# EAGLE design BatMeas5.2 JST (EAGLE 9.4.2)
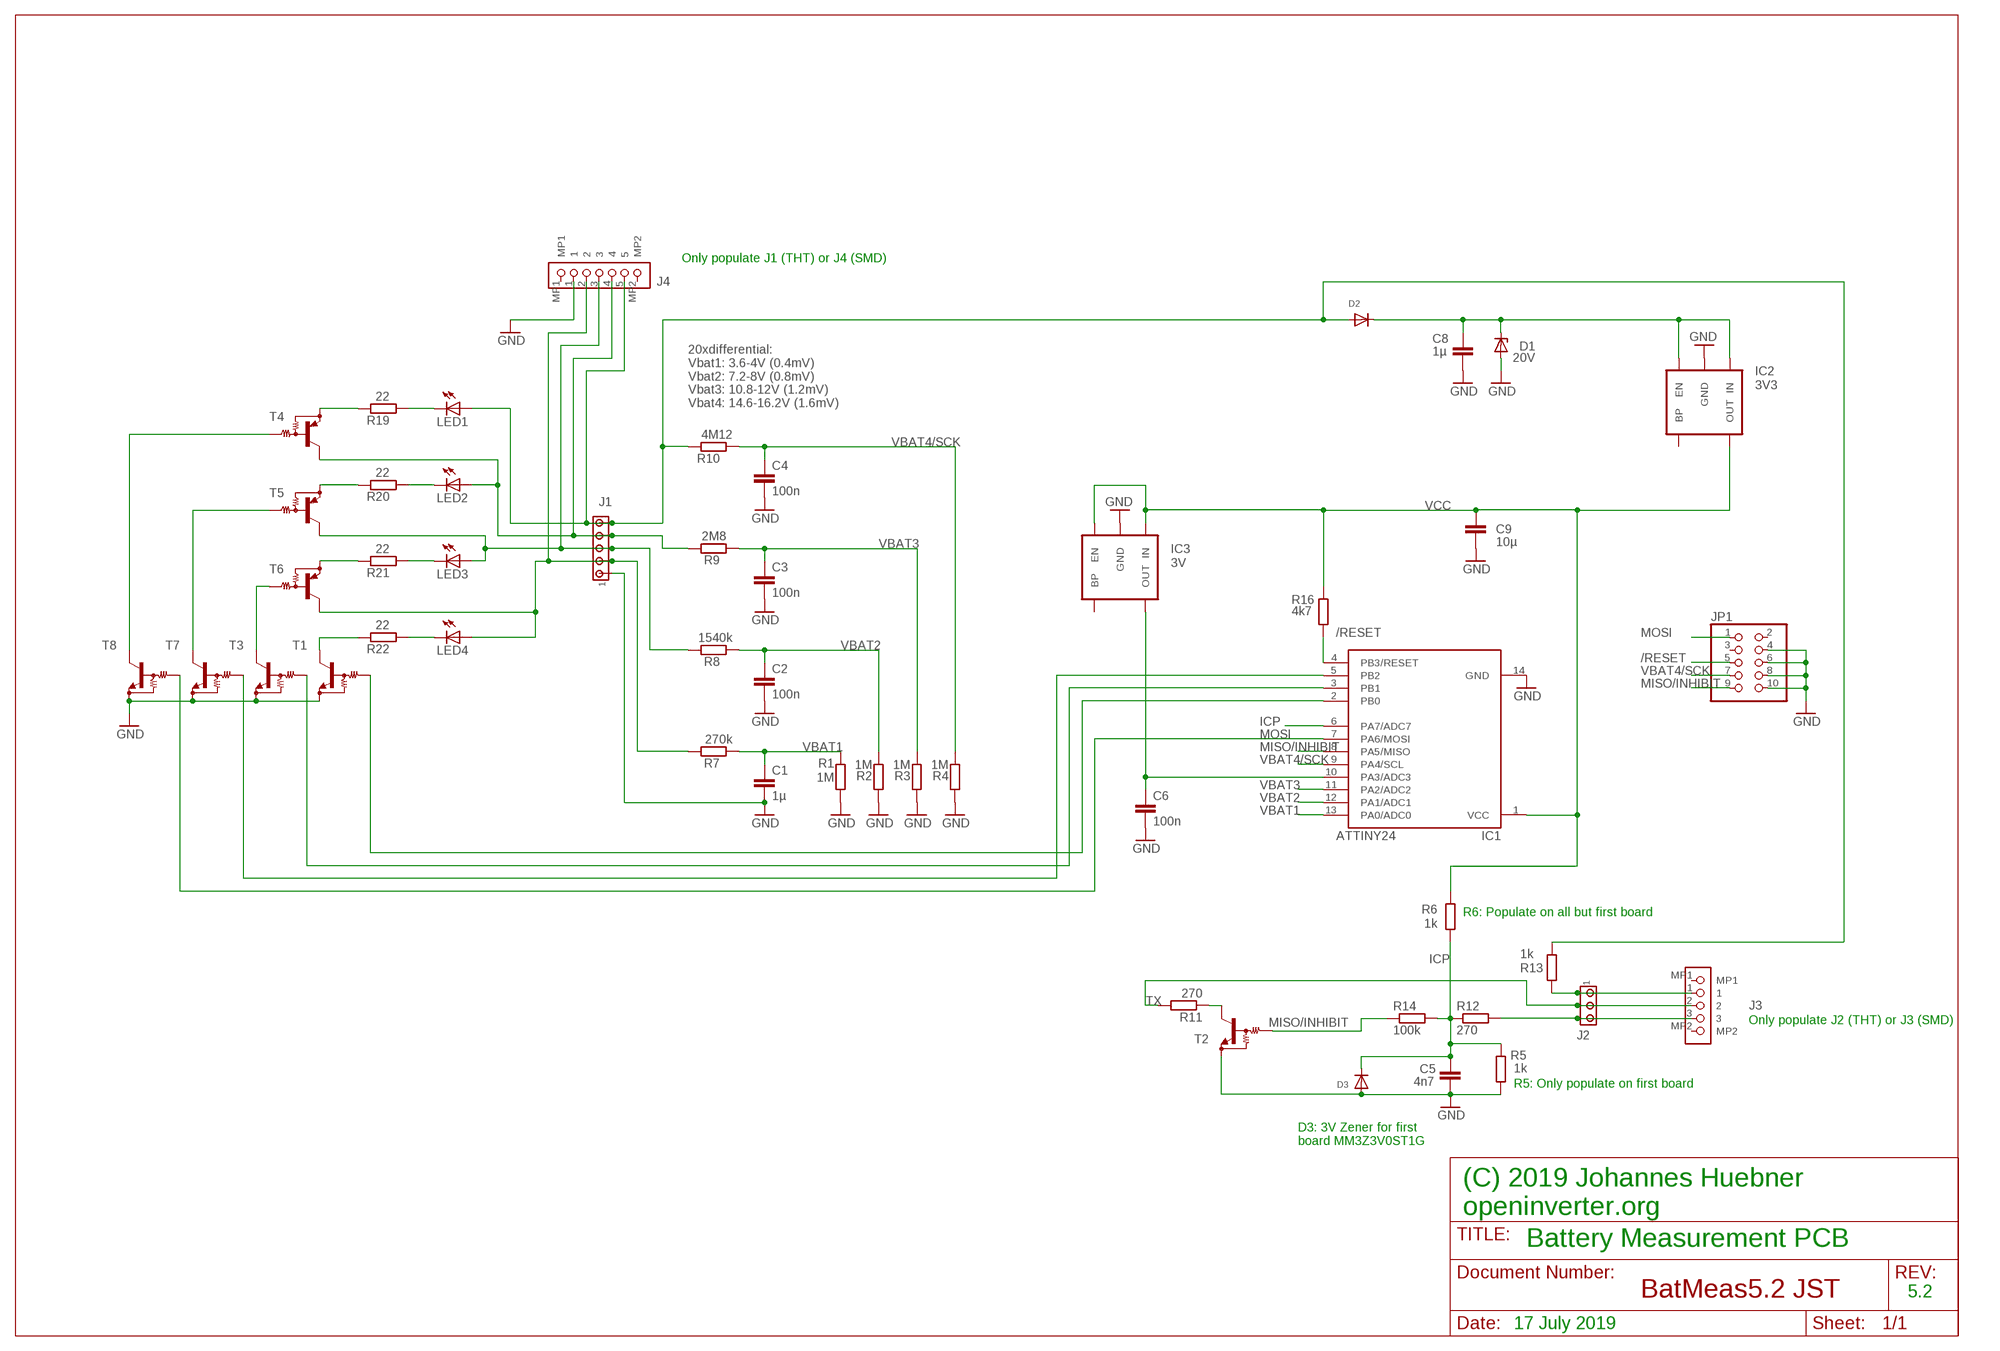
[diagram p0: schematic, sheet 1]

## Parts
C1  1µ  C-EUC0603  [C0603]
C2  100n  C-EUC0603  [C0603]
C3  100n  C-EUC0603  [C0603]
C4  100n  C-EUC0603  [C0603]
C5  4n7  C-EUC0603  [C0603]
C6  100n  C-EUC0603  [C0603]
C8  1µ  C-EUC0805  [C0805]
C9  10µ  C-EUC0805  [C0805]
D1  20V  ZENER-DIODESMB  [SMB]
D2  DIODESOD-323F  [SOD-323F]
D3  DIODESOD-323F  [SOD-323F]
IC1  ATTINY24  [SO014]
IC2  3V3  V_REG_LDOSMD  [SOT23-5]
IC3  3V  V_REG_LDOSMD  [SOT23-5]
J1  MTA05-100  [10X05MTA]
J2  MTA03-100  [10X03MTA]
J3  BM03B-PASS-1-TFT_(LF)(SN)  [BM03BPASS1TFTLFSN]
J4  BM05B-PASS-1-TFT_(LF)(SN)SMD  [BM05BPASS1TFTLFSN]
JP1  PINHD-2X5  [2X05]
LED1  150060GS75000  LEDCHIPLED_0805  [CHIPLED_0805]
LED2  150060GS75000  LEDCHIPLED_0805  [CHIPLED_0805]
LED3  150060GS75000  LEDCHIPLED_0805  [CHIPLED_0805]
LED4  150060GS75000  LEDCHIPLED_0805  [CHIPLED_0805]
R1  1M  R-EU_R0603  [R0603]
R2  1M  R-EU_R0603  [R0603]
R3  1M  R-EU_R0603  [R0603]
R4  1M  R-EU_R0603  [R0603]
R5  1k  R-EU_R0603  [R0603]
R6  1k  R-EU_R0603  [R0603]
R7  270k  R-EU_R0603  [R0603]
R8  1540k  R-EU_R0603  [R0603]
R9  2M8  R-EU_R0603  [R0603]
R10  4M12  R-EU_R0603  [R0603]
R11  270  R-EU_R0603  [R0603]
R12  270  R-EU_R0603  [R0603]
R13  1k  R-EU_R0603  [R0603]
R14  100k  R-EU_R0603  [R0603]
R16  4k7  R-EU_R0603  [R0603]
R19  22  R-EU_R0805  [R0805]
R20  22  R-EU_R0805  [R0805]
R21  22  R-EU_R0805  [R0805]
R22  22  R-EU_R0805  [R0805]
T1  MMUN2233  MUN2211T1-NPN_DRIVER-SC59-BEC  [SC59-BEC]
T2  MMUN2233  MUN2211T1-NPN_DRIVER-SC59-BEC  [SC59-BEC]
T3  MMUN2233  MUN2211T1-NPN_DRIVER-SC59-BEC  [SC59-BEC]
T4  MMUN2111LT1G  MUN2111T1-PNP_DRIVER-SC59-BEC  [SC59-BEC]
T5  MMUN2111LT1G  MUN2111T1-PNP_DRIVER-SC59-BEC  [SC59-BEC]
T6  MMUN2111LT1G  MUN2111T1-PNP_DRIVER-SC59-BEC  [SC59-BEC]
T7  MMUN2233  MUN2211T1-NPN_DRIVER-SC59-BEC  [SC59-BEC]
T8  MMUN2233  MUN2211T1-NPN_DRIVER-SC59-BEC  [SC59-BEC]

## Nets
/RESET: IC1.4(PB3/RESET) JP1.5 R16.2
GND: C1.2 C2.2 C3.2 C4.2 C5.2 C6.2 C8.2 C9.2 D1.A D3.A IC1.14(GND) IC2.2(GND) IC3.2(GND) J1.1 J4.1 JP1.4 JP1.6 JP1.8 JP1.10 R1.2 R2.2 R3.2 R4.2 R5.1 T1.E T2.E T3.E T7.E T8.E
ICP: C5.1 D3.C IC1.6(PA7/ADC7) R5.2 R6.1 R12.1 R14.2
MISO/INHIBIT: IC1.8(PA5/MISO) JP1.9 R14.1 T2.B
MOSI: IC1.7(PA6/MOSI) JP1.1 T8.B
N$1: T3.C T6.B
N$2: C6.1 IC1.10(PA3/ADC3) IC3.5(OUT)
N$3: IC1.2(PB0) T1.B
N$4: IC1.3(PB1) T3.B
N$5: R19.2 T4.E
N$6: LED1.C R19.1
N$10: IC1.5(PB2) T7.B
N$11: R20.2 T5.E
N$12: J2.1 J3.1 R13.2
N$13: LED2.C R20.1
N$14: R11.1 T2.C
N$17: D2.A J1.5 J4.5 LED1.A R10.2 R13.1
N$18: LED3.C R21.1
N$19: LED4.C R22.1
N$20: R21.2 T6.E
N$21: R22.2 T1.C
N$22: J2.3 J3.3 R12.2
N$23: J1.4 J4.4 LED2.A R9.2 T4.C
N$24: J1.3 J4.3 LED3.A R8.2 T5.C
N$25: J1.2 J4.2 LED4.A R7.2 T6.C
N$30: T5.B T7.C
N$31: T4.B T8.C
TX: J2.2 J3.2 R11.2
VBAT: C8.1 D1.C D2.C IC2.1(IN) IC2.3(EN)
VBAT1: C1.1 IC1.13(PA0/ADC0) R1.1 R7.1
VBAT2: C2.1 IC1.12(PA1/ADC1) R2.1 R8.1
VBAT3: C3.1 IC1.11(PA2/ADC2) R3.1 R9.1
VBAT4/SCK: C4.1 IC1.9(PA4/SCL) JP1.7 R4.1 R10.1
VCC: C9.1 IC1.1(VCC) IC2.5(OUT) IC3.1(IN) IC3.3(EN) R6.2 R16.1
Unconnected: IC2.4(BP) IC3.4(BP) J3.MP1 J3.MP2 J4.MP1 J4.MP2 JP1.2 JP1.3

## Notes on the sheet
- Only populate J1 (THT) or J4 (SMD)
- 20xdifferential:
  Vbat1: 3.6-4V (0.4mV)
  Vbat2: 7.2-8V (0.8mV)
  Vbat3: 10.8-12V (1.2mV)
  Vbat4: 14.6-16.2V (1.6mV)
- R6: Populate on all but first board
- Only populate J2 (THT) or J3 (SMD)
- R5: Only populate on first board
- D3: 3V Zener for first
  board MM3Z3V0ST1G
- (C) 2019 Johannes Huebner
  openinverter.org
- Battery Measurement PCB
- 5.2
- 17 July 2019

## Library data of the parts
C1-C6 C8 C9 = rcl:C-EU: CAPACITOR, European symbol
D1 = diode:ZENER-DIODE: Z-Diode
D2 D3 = adafruit:DIODE: Diode SMADIODE - SMA Surface Mount Package 20V 1A Schottky Diode Digikey: 641-1014-6-ND DO-1N4148 - Through Hole Small Current Diode SOD-123 20V 1 A (.5mV Vf) Schottky Diode - Digikey: MBRX120TPMSCT-ND SOD-323 10V 570mA (.38mV Vf, 3ns) Schottky Diode - Digikey: ZLLS410CT-ND SOD-523 30V 30mA Schottky Diode (RB751S-40TE61) - Digikey: RB751S-40TE61CT-ND SOT23-R/W - SOT23 Package (R = Solder Paste/Reflow Ovens, W = Hand-Soldering) BAT54Film 40V 300mA - Digikey: 497-7162-1-ND
IC1 = sparkfun:ATTINY24
IC2 IC3 = SparkFun-PowerIC:V_REG_LDO: Voltage Regulator LDO Standard 150mA LDO voltage regulator in SOT-23 layout. Micrel part MIC5205. BP (by-pass) pin is used to lower output noise with 470pF cap.
J1 = con-amp:MTA05-100: AMP connector
J2 = con-amp:MTA03-100: AMP connector
J3 = BM03B-PASS-1-TFT_(LF)(SN):BM03B-PASS-1-TFT_(LF)(SN): Conn Shrouded Header HDR 3 POS 2mm Solder ST SMD T/R Source: Datasheet <http://www.jst-mfg.com/product/pdf/eng/ePA-F.pdf>; DESCRIPTION: Conn Shrouded Header HDR 3 POS 2mm Solder ST SMD T/R; HEIGHT: 8.8mm; MANUFACTURER_NAME: JST (JAPAN SOLDERLESS TERMINALS); MANUFACTURER_PART_NUMBER: BM03B-PASS-1-TFT (LF)(SN)
J4 = BM03B-PASS-1-TFT_(LF)(SN):BM05B-PASS-1-TFT_(LF)(SN): Conn Shrouded Header HDR 5 POS 2mm Solder ST SMD T/R Source: Datasheet <http://www.jst-mfg.com/product/pdf/eng/ePA-F.pdf>
JP1 = pinhead:PINHD-2X5: PIN HEADER
LED1-LED4 = led:LED: LED OSRAM: - CHIPLED LG R971, LG N971, LY N971, LG Q971, LY Q971, LO R971, LY R971 LH N974, LH R974 LS Q976, LO Q976, LY Q976 LO Q996 - Hyper CHIPLED LW Q18S LB Q993, LB Q99A, LB R99A - SideLED LS A670, LO A670, LY A670, LG A670, LP A670 LB A673, LV A673, LT A673, LW A673 LH A674 LY A675 LS A676, LA A676, LO A676, LY A676, LW A676 LS A679, LY A679, LG A679 - Hyper Micro SIDELED® LS Y876, LA Y876, LO Y876, LY Y876 LT Y87S - SmartLED LW L88C, LW L88S LB L89C, LB L89S, LG L890 LS L89K, LO L89K, LY L89K LS L896, LA L896, LO L896, LY L896 - TOPLED LS T670, LO T670, LY T670, LG T670, LP T670 LSG T670, LSP T670, LSY T670, LOP T670, LYG T670 LG T671, LOG T671, LSG T671 LB T673, LV T673, LT T673, LW T673 LH T674 LS T676, LA T676, LO T676, LY T676, LB T676, LH T676, LSB T676, LW T676 LB T67C, LV T67C, LT T67C, LS T67K, LO T67K, LY T67K, LW E67C LS E67B, LA E67B, LO E67B, LY E67B, LB E67C, LV E67C, LT E67C LW T67C LS T679, LY T679, LG T679 LS T770, LO T770, LY T770, LG T770, LP T770 LB T773, LV T773, LT T773, LW T773 LH T774 LS E675, LA E675, LY E675, LS T675 LS T776, LA T776, LO T776, LY T776, LB T776 LHGB T686 LT T68C, LB T68C - Hyper Mini TOPLED® LB M676 - Mini TOPLED Santana® LG M470 LS M47K, LO M47K, LY M47K Source: http://www.osram.convergy.de LUXEON: - LUMILED® LXK2-PW12-R00, LXK2-PW12-S00, LXK2-PW14-U00, LXK2-PW14-V00 LXK2-PM12-R00, LXK2-PM12-S00, LXK2-PM14-U00 LXK2-PE12-Q00, LXK2-PE12-R00, LXK2-PE12-S00, LXK2-PE14-T00, LXK2-PE14-U00 LXK2-PB12-K00, LXK2-PB12-L00, LXK2-PB12-M00, LXK2-PB14-N00, LXK2-PB14-P00, LXK2-PB14-Q00 LXK2-PR12-L00, LXK2-PR12-M00, LXK2-PR14-Q00, LXK2-PR14-R00 LXK2-PD12-Q00, LXK2-PD12-R00, LXK2-PD12-S00 LXK2-PH12-R00, LXK2-PH12-S00 LXK2-PL12-P00, LXK2-PL12-Q00, LXK2-PL12-R00 Source: www.luxeon.com KINGBRIGHT: KA-3528ASYC Source: www.kingbright.com
R1-R14 R16 R19-R22 = rcl:R-EU_: RESISTOR, European symbol
T1-T3 T7 T8 = transistor:*-NPN_DRIVER-: NPN Bias Resistor Transistor
T4-T6 = transistor:*-PNP_DRIVER-: PNP Bias Resistor Transistor

## Board
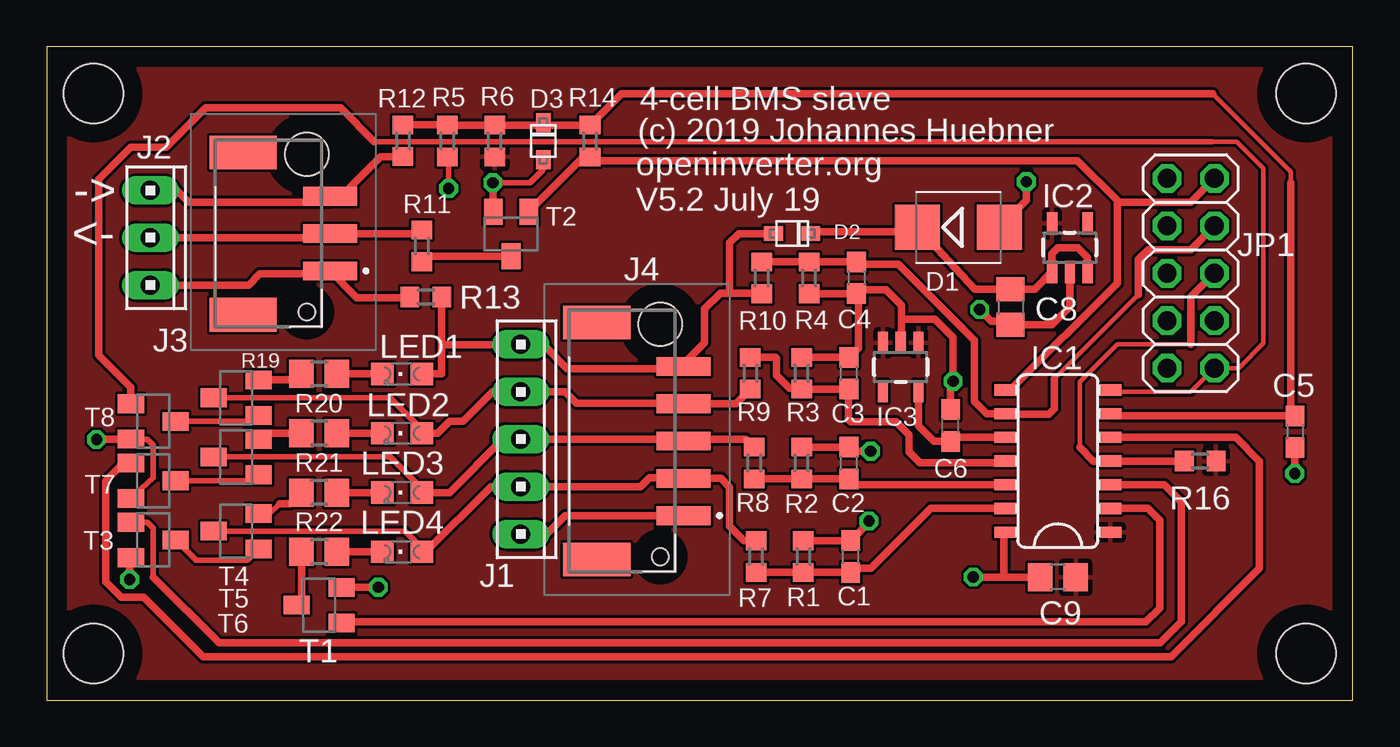
[diagram p1: board, top side]
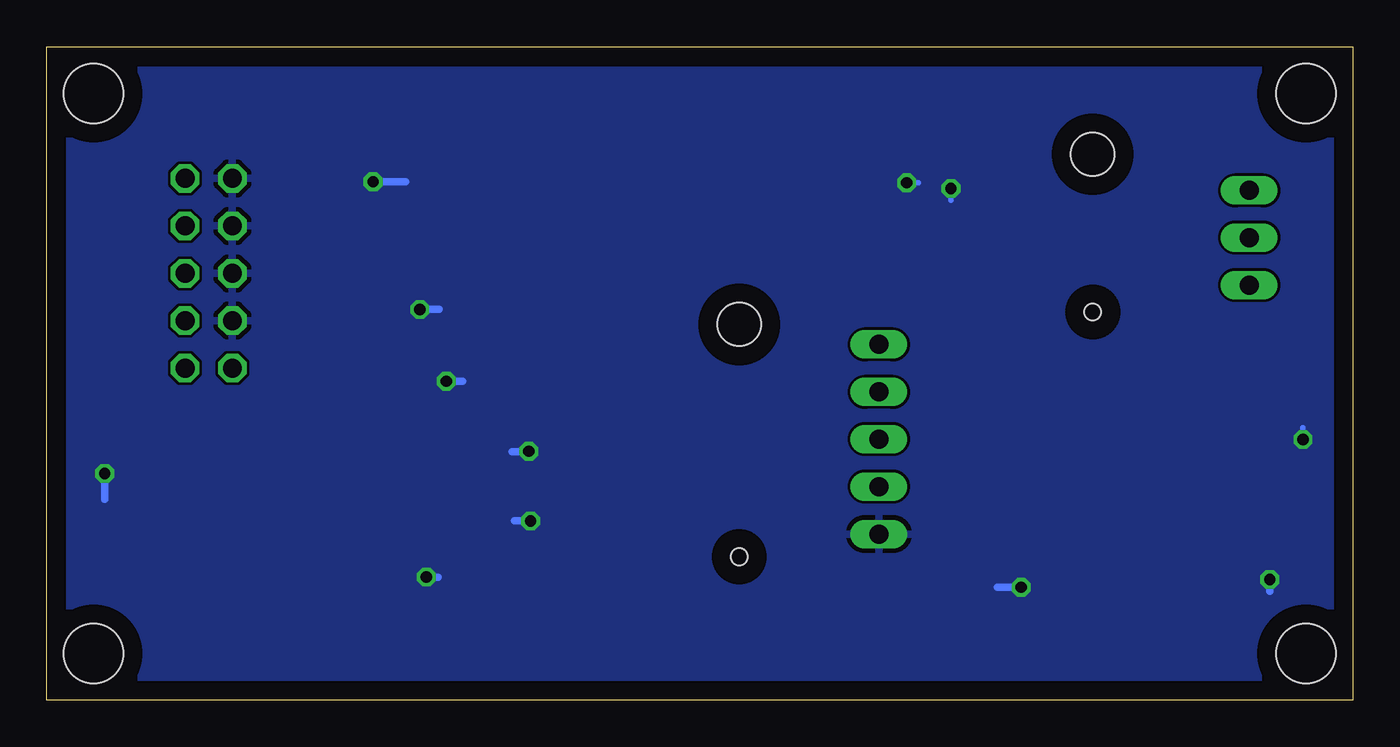
[diagram p2: board, bottom side, seen from below]

Size 70 x 35 mm. Coordinates in mm from the lower left corner, seen from the top.
Outline: 0,0 70,0 70,35 0,35 0,0
Copper layers (1*16): Top 0.035mm / dielectric 1.5mm / Bottom 0.035mm
Design rules "default *": minimum track width 10mil, minimum drill 0.4mm, track to track 6mil, track to pad 6mil, pad to pad 6mil, via to via 6mil, smd to smd 6mil, copper to edge 40mil, drill to drill 8mil, minimum pad ring 10mil, minimum via ring 8mil, stop-mask expansion 4mil, vias tented up to drill 0mil, thermal gap 10mil
Holes 3.2 mm at 2.5,32.5 2.5,2.5 67.5,2.5 67.5,32.5

### Footprints (pad centres in the part's own frame; a part is rotated, then mirrored left to right if it is on the bottom)
C0603 = smd 1.1 x 1: 1 -0.85,0; 2 0.85,0
C0805 = smd 1.3 x 1.5: 1 -0.95,0; 2 0.95,0
SMB = smd 2.4 x 2.4: A 2.2,0; C -2.2,0
SOD-323F = smd 1 x 0.8: A -1,0; C 1,0
SO014 = smd 0.6 x 1.2: 1 -3.175,-2.8; 2 -1.905,-2.8; 3 -0.635,-2.8; 4 0.635,-2.8; 5 1.905,-2.8; 6 3.175,-2.8; 7 4.445,-2.8; 8 4.445,2.8; 9 3.175,2.8; 10 1.905,2.8; 11 0.635,2.8; 12 -0.635,2.8; 13 -1.905,2.8; 14 -3.175,2.8
SOT23-5 = smd 0.55 x 1.2: 1 -0.95,-1.3; 2 0,-1.3; 3 0.95,-1.3; 4 0.95,1.3; 5 -0.95,1.3
10X05MTA = drill 1.016 long: 1 5.08,0; 2 2.54,0; 3 0,0; 4 -2.54,0; 5 -5.08,0
10X03MTA = drill 1.016 long: 1 2.54,0; 2 0,0; 3 -2.54,0
BM03BPASS1TFTLFSN = smd 1 x 2.9: 1 2,3.075; 2 0,3.075; 3 -2,3.075 | smd 1.8 x 3.6: MP1 -4.35,-1.575; MP2 4.35,-1.575 | hole 2.326: -4.25,1.825 | hole 0.9: 4.2,1.825
BM05BPASS1TFTLFSN = smd 1 x 2.9: 1 2,3.075; 2 0,3.075; 3 -2,3.075; 4 -4,3.075; 5 -6,3.075 | smd 1.8 x 3.6: MP1 -8.35,-1.575; MP2 4.35,-1.575 | hole 2.326: -8.25,1.825 | hole 0.9: 4.2,1.825
2X05 = drill 1.016 octagon: 1 -5.08,-1.27; 2 -5.08,1.27; 3 -2.54,-1.27; 4 -2.54,1.27; 5 0,-1.27; 6 0,1.27; 7 2.54,-1.27; 8 2.54,1.27; 9 5.08,-1.27; 10 5.08,1.27
CHIPLED_0805 = smd 1.2 x 1.2: A 0,-1.05; C 0,1.05
R0603 = smd 1 x 1.1: 1 -0.85,0; 2 0.85,0
R0805 = smd 1.3 x 1.5: 1 -0.95,0; 2 0.95,0
SC59-BEC = smd 1 x 1.4: B -0.95,-1.2; C 0,1.2; E 0.95,-1.2

### Placement (x,y rotation side)
C1  43.09,7.68 90 top
C2  42.99,12.7 90 top
C3  42.99,17.5 90 top
C4  43.4,22.61 270 top
C5  66.89,14.37 270 top
C6  48.45,14.71 90 top
C8  51.66,21.05 270 top
C9  54.2,6.58 180 top
D1  48.87,25.32 0 top
D2  39.95,24.99 0 top
D3  26.61,29.95 90 top
IC1  54.2,12.16 90 top
IC2  54.83,24.23 0 top
IC3  45.77,17.84 180 top
J1  25.4,13.97 270 top
J2  5.55,24.77 270 top
J3  12.11,24.99 270 top
J4  31.06,11.88 270 top
JP1  61.31,22.86 90 top
LED1  19.05,17.46 90 top
LED2  19.05,14.29 90 top
LED3  19.05,11.12 90 top
LED4  19.05,7.94 90 top
R1  40.55,7.68 90 top
R2  40.45,12.7 90 top
R3  40.45,17.5 90 top
R4  40.85,22.61 270 top
R5  21.47,29.95 90 top
R6  24.01,29.95 270 top
R7  38.02,7.68 90 top
R8  37.91,12.7 90 top
R9  37.72,17.5 270 top
R10  38.31,22.61 270 top
R11  20.11,24.33 90 top
R12  19.1,29.96 270 top
R13  20.32,21.59 180 top
R14  29.12,29.95 90 top
R16  61.81,12.8 180 top
R19  14.61,17.46 180 top
R20  14.61,14.29 180 top
R21  14.61,11.12 180 top
R22  14.61,7.94 180 top
T1  14.61,5.08 90 top
T2  24.89,24.96 180 top
T3  5.71,8.57 270 top
T4  10.16,16.2 90 top
T5  10.16,13.02 90 top
T6  10.16,9.04 90 top
T7  5.71,11.75 270 top
T8  5.71,14.93 270 top

### Tracks (layer width: path | path; a pad name or v marks a point on that pad's centre or on a via)
/RESET
  Top 0.254: 55.37,13.54 55.37,17.05 57.37,19.05 61.31,19.05
  Top 0.406: 55.37,13.54 56.1,12.8 IC1.4 R16.2 | JP1.5 61.31,21.59 61.31,19.05
GND  (via drill 0.6)
  Top 0.305: D3.A 26.61,28.41 25.91,27.7 v23.91,27.7 | T7.E 5.71,11.9 5.71,13.65 5.39,13.97 T8.E 4.29,13.65 | R5.1 21.45,29.07 21.45,29 21.54,28.91 v21.54,27.41
  Top 0.406: T1.E v17.78,6.04 | R1.2 C1.2 44.15,9.59 v44.06,9.59 | R2.2 C2.2 43.21,13.33 v44.16,13.33 | R3.2 C3.2 43.49,18.86 43.49,21.66 C4.2 | R4.2 C4.2 | C6.2 48.45,16.95 v48.58,17.08 48.58,19.43 47.6,20.4 45.8,20.4 | IC3.2 45.8,19.7 45.8,20.4 | 45.8,20.4 45.8,21.14 44.97,21.96 43.59,21.96 C4.2 | T2.E 23.91,26.18 v23.91,27.7 | D1.A 52.51,26.76 v52.51,27.77 | T3.E 4.45,7.46 v4.45,6.45 | IC2.2 54.83,21.05 53.88,20.11 C8.2 51.48,20.29 50.63,20.29 v50,20.92 | C9.2 51.3,6.58 | 51.3,6.58 v49.66,6.58 | IC1.14 51.3,8.99 51.3,6.59 51.3,6.58 | v2.67,13.96 2.69,13.97 T8.E | C5.2 v66.89,12.13 | J4.1 27.77,9.88 26.79,8.89 J1.1
  Bottom 0.305: v23.91,27.7 23.28,27.7 | v2.67,13.96 2.67,14.59 | v21.54,27.41 21.54,26.77
  Bottom 0.406: v17.78,6.04 19.05,6.04 | 44.94,9.59 v44.06,9.59 | v44.16,13.33 44.2,13.3 45.06,13.3 | 47.7,17.08 v48.58,17.08 | v52.51,27.77 50.77,27.77 | v4.45,6.45 4.45,5.82 | v50,20.92 48.97,20.92 | v49.66,6.58 49.02,6.58 | v66.89,12.13 66.89,10.76
  pour Bottom: 1.2,33.8 68.8,33.8 68.8,1.2 1.2,1.2
ICP
  Top 0.254: 62.48,32.48 66.67,28.3 66.67,27.7
  Top 0.406: IC1.6 57.09,15.24 66.88,15.24 C5.1 66.67,15.45 66.67,27.7 | 62.48,32.48 30.81,32.48 R14.2 26.77,30.8 D3.C 26.46,30.8 R6.1 R5.2 21.46,30.81 R12.1
MISO/INHIBIT
  Top 0.406: 57.37,26.67 57.37,22.32 51.66,16.61 IC1.8 | 57.37,26.67 57.37,26.77 55.24,28.9 29.32,28.9 R14.1 28.77,29.09 T2.B | 57.37,26.67 61.31,26.67 JP1.9
MOSI
  Top 0.254: 57.09,16.51 61.31,16.51 JP1.1 63.88,17.78 65.2,19.1 65.2,28.5 63.78,29.91 62.48,29.91
  Top 0.305: 62.48,29.91 17.55,29.91
  Top 0.406: 57.09,16.51 IC1.7 | 17.55,29.91 15.75,31.71 8.52,31.71 6.4,29.6 4.5,29.6 2.8,27.9 2.8,18.48 4.51,16.76 T8.B
N$1
  Top 0.305: T6.B 10.74,7.47 8.02,7.47 T3.C
N$2
  Top 0.406: IC1.10 48.66,14.07 C6.1 47.55,13.86 46.72,14.68 IC3.5
N$3
  Top 0.406: IC1.2 59.01,10.26 59.65,9.62 59.65,4.92 58.91,4.18 15.85,4.18 T1.B
N$4
  Top 0.305: 5.71,6.58 5.71,9.21 5.4,9.53 T3.B
  Top 0.406: IC1.3 59.91,11.53 60.81,10.62 60.81,4.18 59.69,3.06 9.24,3.06 5.71,6.58
N$5
  Top 0.305: 13.34,17.14 R19.2
  Top 0.406: T4.E 13.34,17.14
N$6
  Top 0.406: R19.1 LED1.C
N$10
  Top 0.406: IC1.5 63.72,14.07 64.99,12.8 64.99,7.04 60.27,2.32 8.38,2.32 5.2,5.5 4,5.5 3.17,6.33 3.17,11.75 4.12,12.7 T7.B
N$11
  Top 0.305: T5.E 11.68,14.29
  Top 0.406: 11.68,14.29 R20.2
N$12
  Top 0.406: J2.1 10.81,22.23 11.41,22.82 15.03,22.82 J3.1 16.62,21.56 19.44,21.56 R13.2
N$13
  Top 0.406: R20.1 LED2.C
N$14
  Top 0.406: R11.1 20.39,23.77 T2.C
N$17
  Top 0.406: LED1.A 21.17,17.46 21.17,19.02 | 21.17,19.02 R13.1 | J1.5 25.37,19.02 | 25.37,19.02 21.17,19.02 | J4.5 34.13,18.01 | 34.13,18.01 35.27,19.14 35.27,20.97 36.1,21.8 36.6,21.8 | 36.6,21.8 38.28,21.8 R10.2 | D2.A 37.09,24.99 36.6,24.5 36.6,21.8 | 34.13,18.01 33.87,17.74 27.9,17.74 26.62,19.02 25.37,19.02
N$18
  Top 0.406: R21.1 LED3.C
N$19
  Top 0.406: R22.1 LED4.C
N$20
  Top 0.305: T6.E 11.96,9.99 12.48,10.52
  Top 0.406: 12.48,10.52 13.05,10.52 R21.2
N$21
  Top 0.305: T1.C 13.65,5.23
  Top 0.406: 13.65,5.23 R22.2
N$22
  Top 0.406: J2.3 6.97,27.3 7.62,26.66 15.19,26.66 J3.3 15.79,26.99 17.91,29.11 R12.2
N$23
  Top 0.305: T4.C 18.41,16.2 20.1,14.51 LED2.A
  Top 0.406: LED2.A 20.95,14.29 21.59,14.93 22.32,14.93 23.9,16.51 J1.4 27.79,16.51 28.4,15.9 34.11,15.9 J4.4 36.94,15.88 R9.2
N$24
  Top 0.305: T5.C 18.41,13.02 20.1,11.34 LED3.A
  Top 0.406: 20.1,11.34 20.32,11.12 21.59,11.12 24.45,13.97 J1.3 34.04,13.97 J4.3 34.23,13.97 37.49,13.97 R8.2
N$25
  Top 0.305: T6.C 19.21,9.04 20.1,8.16 LED4.A 20.32,7.94
  Top 0.406: 20.32,7.94 23.81,11.43 J1.2 31.83,11.43 32.3,11.9 34.11,11.9 J4.2 36.12,11.88 36.6,11.4 36.6,9.3 37.37,8.54 R7.2
N$30
  Top 0.305: T5.B 11.04,11.75 T7.C
N$31
  Top 0.305: 6.88,14.99 7.59,14.93 10.79,14.93 11.12,15.24 T4.B
  Top 0.406: T8.C 6.88,14.99
TX
  Top 0.406: R11.2 19.89,24.96 15.21,24.96 J3.2 14.97,24.77 J2.2
VBAT
  Top 0.254: 55.26,24.23 55.33,24.16
  Top 0.406: D2.C 41.05,25.09 46.66,25.09 D1.C 49.74,22 C8.1 52.95,22 IC2.1 53.88,23.91 54.2,24.23 55.26,24.23 | IC2.3 55.78,23.71 55.33,24.16
VBAT1
  Top 0.406: R7.1 R1.1 C1.1 43.31,7.05 44.16,7.05 47.38,10.26 IC1.13
VBAT2
  Top 0.406: R8.1 R2.1 C2.1 43.3,11.54 43.28,11.53 IC1.12
VBAT3
  Top 0.406: R9.1 39.05,18.36 39.1,18.3 39.1,17.4 39.8,16.7 40.4,16.7 R3.1 C3.1 42.98,16.68 42.98,15.03 43.1,14.9 45.5,14.9 46.2,14.2 46.2,13.3 46.8,12.7 51.3,12.7 IC1.11
VBAT4/SCK
  Top 0.254: 54,17.2 58.5,21.7
  Top 0.406: R10.1 R4.1 C4.1 43.51,23.35 45.65,23.35 49.72,19.28 49.72,16.01 50.38,15.34 IC1.9 51.59,15.34 52.02,15.32 53.72,15.32 54,15.6 54,17.2 | JP1.7 61.31,24.13 59.03,24.13 58.5,23.6 58.5,21.7
VCC
  pour Top: 1.2,33.8 68.8,33.8 68.8,1.2 1.2,1.2

### Text on the board
tNames: 4-cell BMS slave | (c) 2019 Johannes Huebner | openinverter.org | -> | <- | V5.2 July 19